# Altium schematic sheet Sheet1.SchDoc: Наименование
size 420 x 297 mm; ApprovedBy: Утвердил; CheckedBy: Проверил; Author: Разработал; CompanyName: Организация; DrawnBy: Н.Контр; Engineer: Т.Контр; SheetNumber: 1; SheetTotal: 1; PageSetup: Record=PageOptions|CenterHorizontal=True|CenterVertical=True|PrintScale=0.94|XCorrection=1.00|YCorrection=1.00|PrintKind=1|BorderSize=5000000|LeftOffset=0|BottomOffset=0|Orientation=1|PaperLength=1000|PaperWidth=1000|Scale=100|PaperSource=7|PrintQuality=-4|MediaType=1|DitherType=10|PaperKind=A4|PrintScaleMode=1; DecimalNumber: Децимальный номер; HeadOfSector: Нач. сектора; MainDevice: Перв.примен.; Name: Наименование; DocumentName: Sheet1.SCHDOC
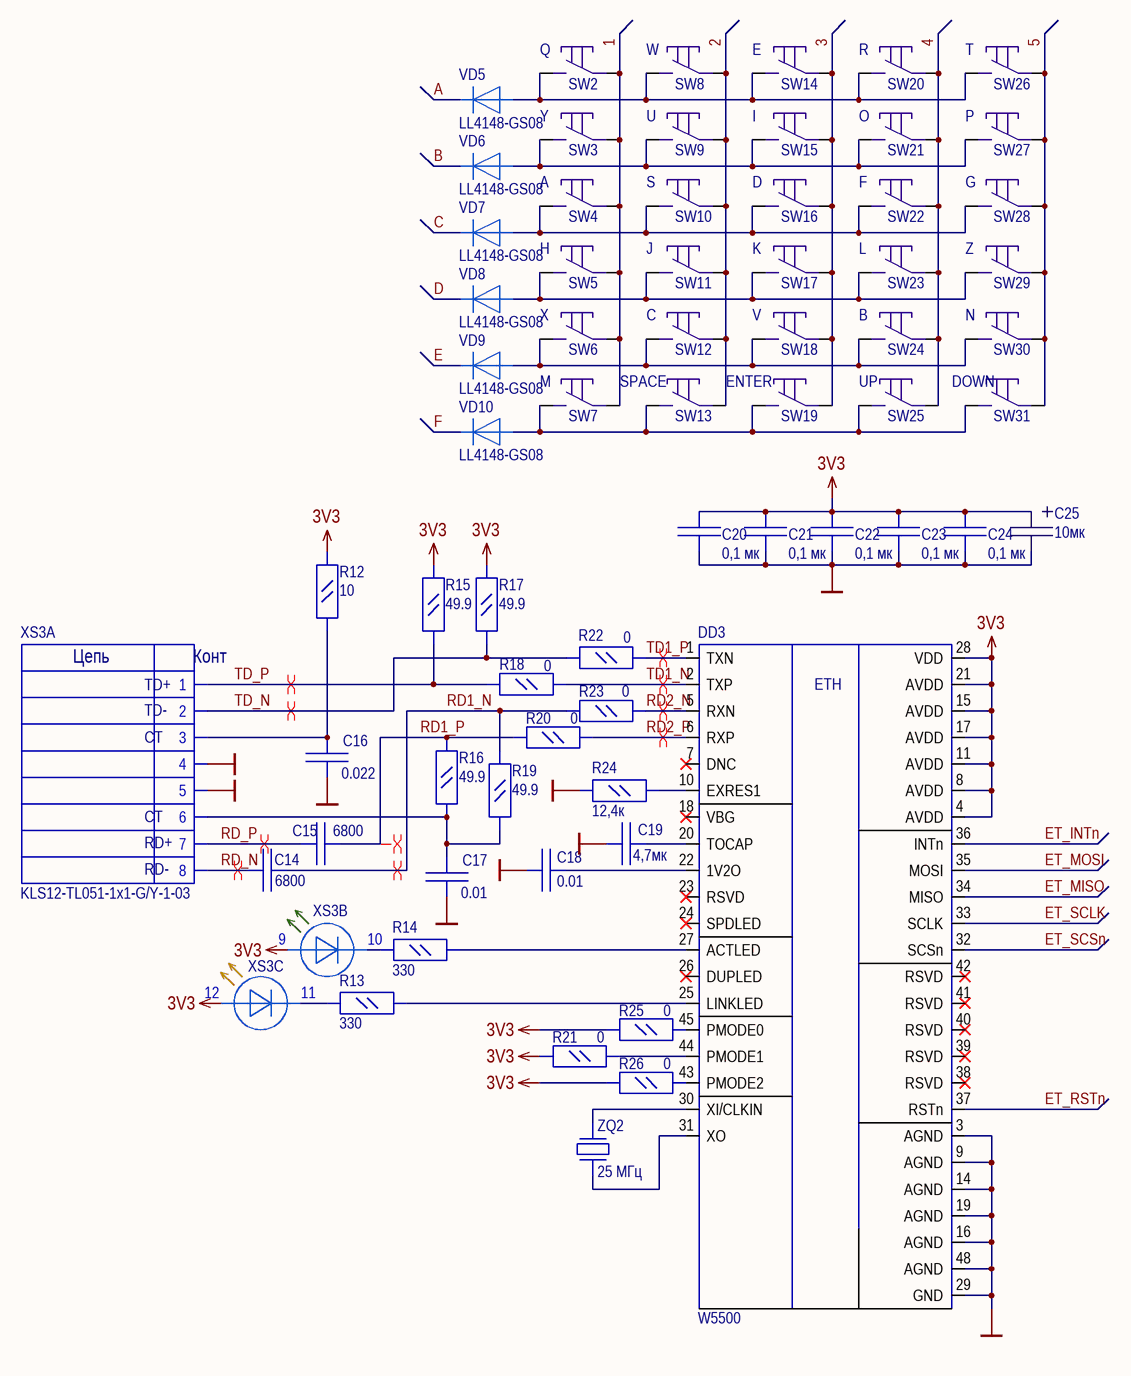
[diagram p0: Sheet1.SchDoc]

## Parts
C14  6800  [C_0805]
C15  6800  [C_0805]
C16  0.022  [C_0805]
C17  0.01  [C_0805]
C18  0.01  [C_0805]
C19  4,7мк  [C_0805]
C20  0,1 мк  [C_0805]
C21  0,1 мк  [C_0805]
C22  0,1 мк  [C_0805]
C23  0,1 мк  [C_0805]
C24  0,1 мк  [C_0805]
C25  10мк  [D_CASE]
DD3  W5500  [LQFP48]
R12  10  [R_0805]
R13  330  [R_0805]
R14  330  [R_0805]
R15  49.9  [R_0805]
R16  49.9  [R_0805]
R17  49.9  [R_0805]
R18  0  [R_0805]
R19  49.9  [R_0805]
R20  0  [R_0805]
R21  0  [R_0805]
R22  0  [R_0805]
R23  0  [R_0805]
R24  12,4к  [R_0805]
R25  0  [R_0805]
R26  0  [R_0805]
SW2  KLS7-TS6604  [KLS7-TS6604-5.0-180-B]  (value not drawn)
SW3  KLS7-TS6604  [KLS7-TS6604-5.0-180-B]  (value not drawn)
SW4  KLS7-TS6604  [KLS7-TS6604-5.0-180-B]  (value not drawn)
SW5  KLS7-TS6604  [KLS7-TS6604-5.0-180-B]  (value not drawn)
SW6  KLS7-TS6604  [KLS7-TS6604-5.0-180-B]  (value not drawn)
SW7  KLS7-TS6604  [KLS7-TS6604-5.0-180-B]  (value not drawn)
SW8  KLS7-TS6604  [KLS7-TS6604-5.0-180-B]  (value not drawn)
SW9  KLS7-TS6604  [KLS7-TS6604-5.0-180-B]  (value not drawn)
SW10  KLS7-TS6604  [KLS7-TS6604-5.0-180-B]  (value not drawn)
SW11  KLS7-TS6604  [KLS7-TS6604-5.0-180-B]  (value not drawn)
SW12  KLS7-TS6604  [KLS7-TS6604-5.0-180-B]  (value not drawn)
SW13  KLS7-TS6604  [KLS7-TS6604-5.0-180-B]  (value not drawn)
SW14  KLS7-TS6604  [KLS7-TS6604-5.0-180-B]  (value not drawn)
SW15  KLS7-TS6604  [KLS7-TS6604-5.0-180-B]  (value not drawn)
SW16  KLS7-TS6604  [KLS7-TS6604-5.0-180-B]  (value not drawn)
SW17  KLS7-TS6604  [KLS7-TS6604-5.0-180-B]  (value not drawn)
SW18  KLS7-TS6604  [KLS7-TS6604-5.0-180-B]  (value not drawn)
SW19  KLS7-TS6604  [KLS7-TS6604-5.0-180-B]  (value not drawn)
SW20  KLS7-TS6604  [KLS7-TS6604-5.0-180-B]  (value not drawn)
SW21  KLS7-TS6604  [KLS7-TS6604-5.0-180-B]  (value not drawn)
SW22  KLS7-TS6604  [KLS7-TS6604-5.0-180-B]  (value not drawn)
SW23  KLS7-TS6604  [KLS7-TS6604-5.0-180-B]  (value not drawn)
SW24  KLS7-TS6604  [KLS7-TS6604-5.0-180-B]  (value not drawn)
SW25  KLS7-TS6604  [KLS7-TS6604-5.0-180-B]  (value not drawn)
SW26  KLS7-TS6604  [KLS7-TS6604-5.0-180-B]  (value not drawn)
SW27  KLS7-TS6604  [KLS7-TS6604-5.0-180-B]  (value not drawn)
SW28  KLS7-TS6604  [KLS7-TS6604-5.0-180-B]  (value not drawn)
SW29  KLS7-TS6604  [KLS7-TS6604-5.0-180-B]  (value not drawn)
SW30  KLS7-TS6604  [KLS7-TS6604-5.0-180-B]  (value not drawn)
SW31  KLS7-TS6604  [KLS7-TS6604-5.0-180-B]  (value not drawn)
VD5  LL4148-GS08  [SOD-80]
VD6  LL4148-GS08  [SOD-80]
VD7  LL4148-GS08  [SOD-80]
VD8  LL4148-GS08  [SOD-80]
VD9  LL4148-GS08  [SOD-80]
VD10  LL4148-GS08  [SOD-80]
XS3  KLS12-TL051-1x1-G/Y-1-03  [KLS12-TL051]  (parts A,B,C of 3)
ZQ2  25 МГц  [MQ CRYSTAL]

## Nets
3V3: C20.2 C21.2 C22.2 C23.2 C24.2 C25.1 DD3.4(AVDD) DD3.8(AVDD) DD3.11(AVDD) DD3.15(AVDD) DD3.17(AVDD) DD3.21(AVDD) DD3.28(VDD) R12.2 R15.2 R17.2 R21.1 R25.1 R26.1 XS3.9 XS3.12
GND: C16.1 C17.1 C18.2 C19.2 C20.1 C21.1 C22.1 C23.1 C24.1 C25.2 DD3.3(AGND) DD3.9(AGND) DD3.14(AGND) DD3.16(AGND) DD3.19(AGND) DD3.29(GND) DD3.48(AGND) R24.1 XS3.4 XS3.5
1: SW2.2 SW3.2 SW4.2 SW5.2 SW6.2 SW7.2
2: SW8.2 SW9.2 SW10.2 SW11.2 SW12.2 SW13.2
3: SW14.2 SW15.2 SW16.2 SW17.2 SW18.2 SW19.2
4: SW20.2 SW21.2 SW22.2 SW23.2 SW24.2 SW25.2
5: SW26.2 SW27.2 SW28.2 SW29.2 SW30.2 SW31.2
A: VD5.2
B: VD6.2
C: VD7.2
D: VD8.2
E: VD9.2
ET_INTn: DD3.36(INTn)
ET_MISO: DD3.34(MISO)
ET_MOSI: DD3.35(MOSI)
ET_RSTn: DD3.37(RSTn)
ET_SCLK: DD3.33(SCLK)
ET_SCSn: DD3.32(SCSn)
F: VD10.2
RD1_N: C14.1 R19.2 R23.1
RD1_P: C15.1 R16.2 R20.1
RD2_N: DD3.5(RXN) R23.2
RD2_P: DD3.6(RXP) R20.2
RD_N: C14.2 XS3.8
RD_P: C15.2 XS3.7
TD1_N: DD3.2(TXP) R18.2
TD1_P: DD3.1(TXN) R22.2
TD_N: R17.1 R22.1 XS3.2
TD_P: R15.1 R18.1 XS3.1
NetC16_2: C16.2 R12.1 XS3.3
NetC17_2: C17.2 R16.1 R19.1 XS3.6
NetC18_1: C18.1 DD3.22(1V2O)
NetC19_1: C19.1 DD3.20(TOCAP)
NetDD3_10: DD3.10(EXRES1) R24.2
NetDD3_25: DD3.25(LINKLED) R13.1
NetDD3_27: DD3.27(ACTLED) R14.2
NetDD3_30: DD3.30(XI/CLKIN) ZQ2.1
NetDD3_31: DD3.31(XO) ZQ2.3
NetDD3_43: DD3.43(PMODE2) R26.2
NetDD3_44: DD3.44(PMODE1) R21.2
NetDD3_45: DD3.45(PMODE0) R25.2
NetR13_2: R13.2 XS3.11
NetR14_1: R14.1 XS3.10
NetSW2_1: SW2.1 SW8.1 SW14.1 SW20.1 SW26.1 VD5.1
NetSW3_1: SW3.1 SW9.1 SW15.1 SW21.1 SW27.1 VD6.1
NetSW4_1: SW4.1 SW10.1 SW16.1 SW22.1 SW28.1 VD7.1
NetSW5_1: SW5.1 SW11.1 SW17.1 SW23.1 SW29.1 VD8.1
NetSW6_1: SW6.1 SW12.1 SW18.1 SW24.1 SW30.1 VD9.1
NetSW7_1: SW7.1 SW13.1 SW19.1 SW25.1 SW31.1 VD10.1

Not connected (* = marked no-connect by the designer): DD3 7(DNC)* 18(VBG)* 23(RSVD)* 24(SPDLED)* 26(DUPLED)* 38(RSVD)* 39(RSVD)* 40(RSVD)* 41(RSVD)* 42(RSVD)*

## Layout directives
differential pair: RD1_N, RD1_P, RD2_N, RD2_P, RD_N, RD_P, TD1_N, TD1_P, TD_N, TD_P

## Notes on the sheet
- (near SW2) Q
- (near SW8) W
- (near SW14) E
- (near SW20) R
- (near SW26) T
- (near SW3) Y
- (near SW9) U
- (near SW15) I
- (near SW21) O
- (near SW27) P
- (near SW4) A
- (near SW10) S
- (near SW16) D
- (near SW22) F
- (near SW28) G
- (near SW5) H
- (near SW11) J
- (near SW17) K
- (near SW23) L
- (near SW29) Z
- (near SW6) X
- (near SW12) C
- (near SW18) V
- (near SW24) B
- (near SW30) N
- (near SW7) M
- SPACE
- ENTER
- (near SW25) UP
- (near SW31) DOWN
- Подп. и дата
- Инв.№ дубл.
- Взам.инв.№
- Подп.и дата
- Инв.№ подл.
- Изм.
- Лист
- № докум.
- Подп.
- Дата
- Формат  A3
- (in symbol KLS12-TL051-1x1-G/Y-1-03, part A) Цепь; Конт; TD+; TD-; CT; RD+; RD-
- (in symbol W5500) ETH

## Library data of the parts
C14-C24 = C_0805
C25 = T491D106K035AT: CAP TANT 10UF 10% 35V 2917; Manufacturer: KEMET; Value: 10µF; Part Number: T491D106K035AT; ComponentLink1URL: https://api.kemet.com/component-edge/download/datasheet/T491D106K035AT.pdf; ComponentLink1Description: Datasheet; Component Type: Tantalum Capacitor
DD3 = W5500: Hardwired TCP/IP embedded Ethernet controller
R12-R26 = R_0805
VD5-VD10 = LL4148-GS08: Диод
XS3 = KLS12-TL051-1x1-G/Y-1-03: TJ16S-8P8C Разъем на плату 8-8 (RJ-45)
ZQ2 = MQ-25.000-18